# Altium schematic sheet vesc_can.SchDoc
size A4; SheetNumber: 4; SheetTotal: 5
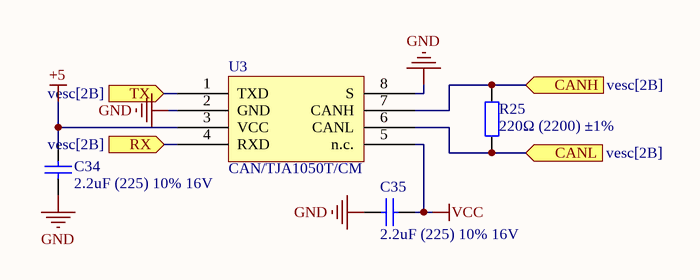
[diagram p0: vesc_can.SchDoc]

## Parts
C34  2.2uF (225) 10% 16V  [0603_C]
C35  2.2uF (225) 10% 16V  [0603_C]
R25  220Ω (2200) ±1%  [0603_R]
U3  CAN/TJA1050T/CM  [SOIC-8_150mil]

## Ports
CANH (in, see vesc[2B]), CANL (in, see vesc[2B]), RX (in, see vesc[2B]), TX (in, see vesc[2B])

## Nets
+5: C34.2 U3.3(VCC)
GND: C34.1 C35.1 U3.2(GND) U3.8(S)
VCC: C35.2 U3.5(n.c.)
CANH: R25.2 U3.7(CANH) ; port CANH
CANL: R25.1 U3.6(CANL) ; port CANL
RX: U3.4(RXD) ; port RX
TX: U3.1(TXD) ; port TX

## Library data of the parts
C34 C35 = 0603 2.2uF (225) 10% 16V: 贴片电容; ComponentLink1Description: 供应商链接; ComponentLink1URL: http://www.szlcsc.com/product/details_24366.html; Package: 0603; Supplier: LC; SuppliersPartNumber: C23630
R25 = 0603 220Ω (2200) 1%: 贴片电阻; ComponentLink1Description: 供应商链接; ComponentLink1URL: http://www.szlcsc.com/product/details_23689.html; Package: 0603; Supplier: LC; SuppliersPartNumber: C22962
U3 = CAN/TJA1050T/CM_[C6952]: CAN; ComponentLink1Description: 供应商链接; ComponentLink1URL: http://www.szlcsc.com/product/details_7424.html; Package: SOIC-8_150mil; Supplier: LC; SuppliersPartNumber: C6952